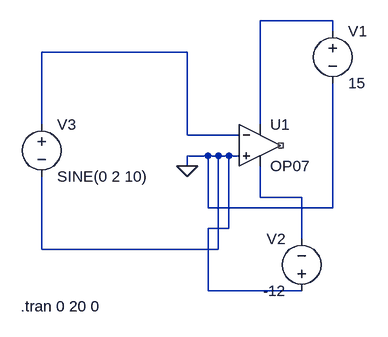
[diagram p0: schematic comparatorwithopamp.asc]
comparatorwithopamp.asc, the LTspice schematic file:
Version 4.1
SHEET 1 880 680
WIRE 272 -32 160 -32
WIRE 272 -16 272 -32
WIRE 48 16 -176 16
WIRE -176 128 -176 16
WIRE 160 128 160 -32
WIRE 48 144 48 16
WIRE 128 144 48 144
WIRE 80 176 48 176
WIRE 96 176 80 176
WIRE 112 176 96 176
WIRE 128 176 112 176
WIRE 48 192 48 176
WIRE 160 240 160 192
WIRE 224 240 160 240
WIRE 80 256 80 176
WIRE 272 256 272 64
WIRE 272 256 80 256
WIRE 112 288 112 176
WIRE 112 288 80 288
WIRE 224 304 224 240
WIRE -176 320 -176 208
WIRE 96 320 96 176
WIRE 96 320 -176 320
WIRE 80 384 80 288
WIRE 224 384 80 384
FLAG 48 192 0
SYMBOL OpAmps\\OP07 160 96 R0
SYMATTR InstName U1
SYMBOL voltage 272 -32 R0
WINDOW 123 0 0 Left 0
WINDOW 39 0 0 Left 0
SYMATTR InstName V1
SYMATTR Value 15
SYMBOL voltage 224 400 R180
WINDOW 0 24 96 Left 2
WINDOW 3 24 16 Left 2
WINDOW 123 0 0 Left 0
WINDOW 39 0 0 Left 0
SYMATTR InstName V2
SYMATTR Value -12
SYMBOL voltage -176 112 R0
WINDOW 123 0 0 Left 0
WINDOW 39 0 0 Left 0
SYMATTR InstName V3
SYMATTR Value SINE(0 2 10)
TEXT -208 408 Left 2 !.tran 0 20 0

The netlist it stands for:
* comparatorwithopamp.asc
X§U1 0 N002 N001 N003 NC_01 LT1001  ; OP07, pins In+ In- V+ V- OUT
V1 N001 0 15
V2 0 N003 -12
V3 N002 0 SINE(0 2 10)
.tran 0 20 0
.lib LTC.lib
.backanno
.end